# Altium project Modulo_NodoConexion.PrjPcb
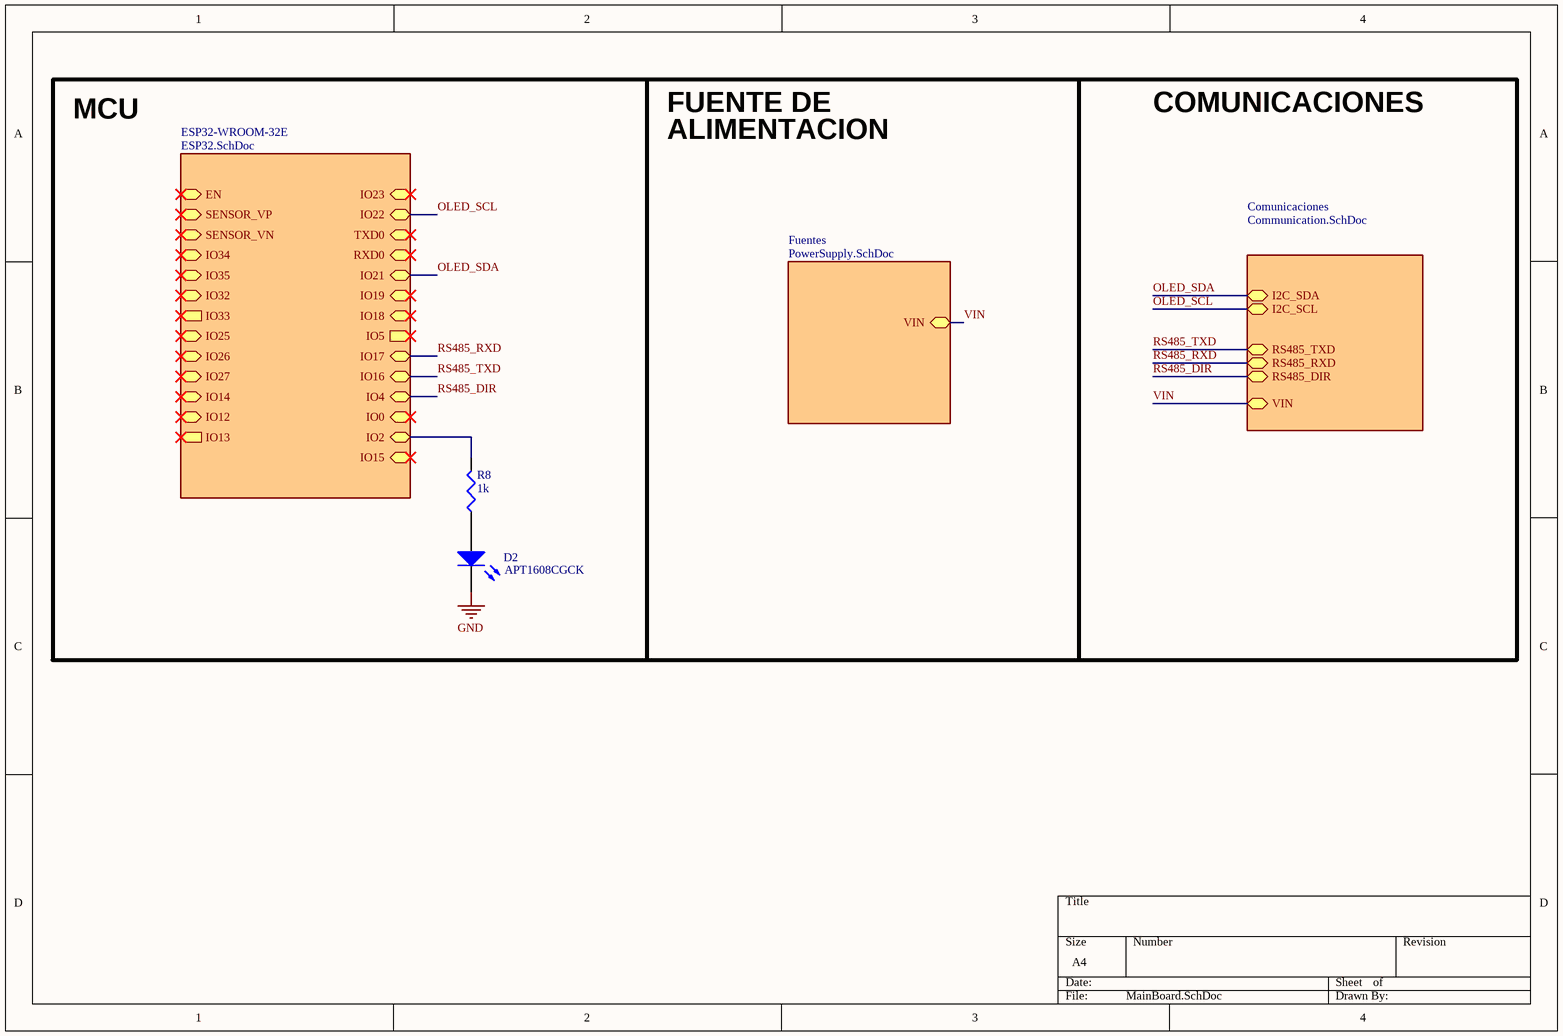
[diagram p0: MainBoard.SchDoc]
4 sheets, 43 parts. Net scope: hierarchical (ports join the sheet entries above them; power ports are global).
Board file: Modulo_Nodo.PcbDoc
Sheets:
  MainBoard.SchDoc
    ESP32-WROOM-32E = ESP32.SchDoc
    Fuentes = PowerSupply.SchDoc
    Comunicaciones = Communication.SchDoc

## Sheet MainBoard.SchDoc
size A4

### Parts
D2  APT1608CGCK  [ChipDiode1608]
R8  1k  [RESC2012N]

### Sub-sheets
Comunicaciones = Communication.SchDoc: I2C_SDA, I2C_SCL, VIN, RS485_DIR, RS485_RXD, RS485_TXD
ESP32-WROOM-32E = ESP32.SchDoc: SENSOR_VN, IO34, SENSOR_VP, IO35, IO32, IO33 (out), IO25, IO26, IO27, IO14, IO12, IO13 (out), IO22, TXD0, RXD0, IO15, IO23, IO21, IO19, IO18, IO5 (out), IO17, IO16, IO4, IO0, IO2, EN
Fuentes = PowerSupply.SchDoc: VIN

### Nets
GND: D2.2(K)
OLED_SCL: sheet ESP32-WROOM-32E/IO22, sheet Comunicaciones/I2C_SCL
OLED_SDA: sheet ESP32-WROOM-32E/IO21, sheet Comunicaciones/I2C_SDA
RS485_DIR: sheet ESP32-WROOM-32E/IO4, sheet Comunicaciones/RS485_DIR
RS485_RXD: sheet ESP32-WROOM-32E/IO17, sheet Comunicaciones/RS485_RXD
RS485_TXD: sheet ESP32-WROOM-32E/IO16, sheet Comunicaciones/RS485_TXD
VIN: sheet Fuentes/VIN, sheet Comunicaciones/VIN
NetD2_1: D2.1(A) R8.1
NetR8_2: R8.2 ; sheet ESP32-WROOM-32E/IO2

### Notes on the sheet
- FUENTE DE
- COMUNICACIONES
- MCU
- ALIMENTACION

### Library data of the parts
D2 = LED2: LED 1.6x0.8 mm 570 nm GRN CLR SMD; Published: 8-Jun-2000; LatestRevisionDate: 17-Jul-2002; LatestRevisionNote: Re-released for DXP Platform.; PackageVersion: Feb-2002; PackageReference: 3.2X1.6X1.1; Publisher: Altium Limited; PackageDescription: SM LED; 2 Flat Leads
R8 = Res3: Resistor; Published: 8-Jun-2000; LatestRevisionDate: 29-May-2009; LatestRevisionNote: IPC-7351 Footprint Added.; PackageReference: J1-0603; Publisher: Altium Limited; PackageDescription: Chip Resistor; Value: 1K

## Sheet ESP32.SchDoc: Microcontrolador
size A4; Author: Matias Herrera
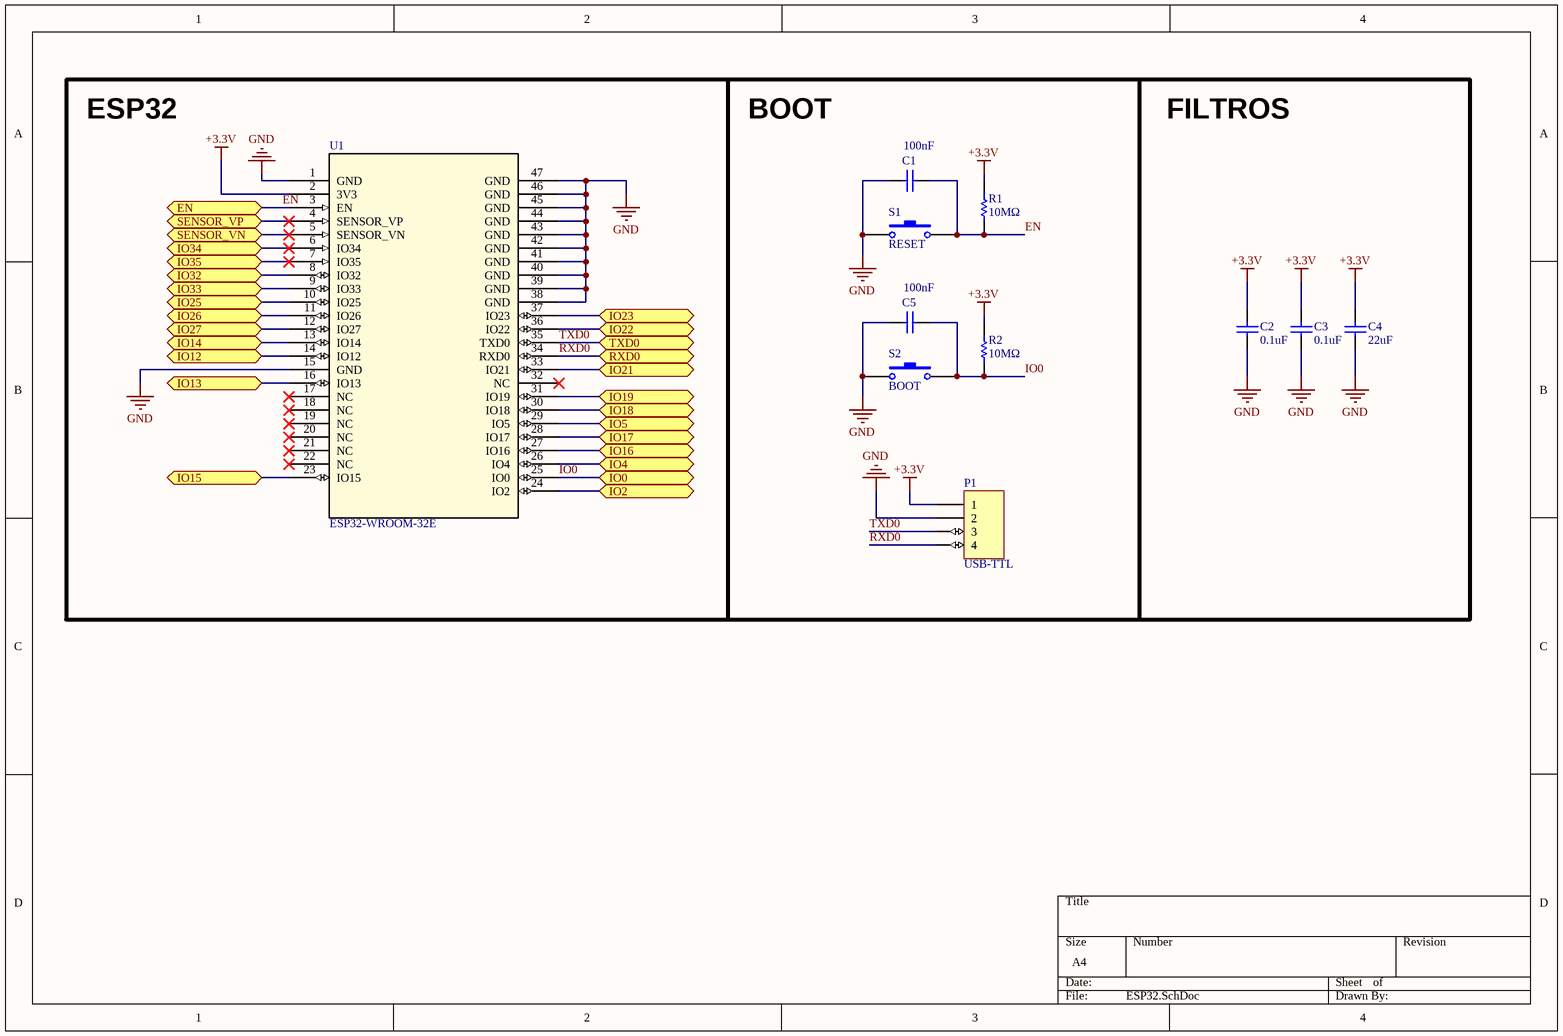
[diagram p1: ESP32.SchDoc]

### Parts
C1  100nF  [CAPC2012N]
C2  0.1uF  [CAPC2012N]
C3  0.1uF  [CAPC2012N]
C4  22uF  [CAPC2012N]
C5  100nF  [CAPC2012N]
P1  USB-TTL  [CONNHDR_1X4_2.54MM]
R1  10MΩ  [RESC2012N]
R2  10MΩ  [RESC2012N]
S1  RESET  [SWITCH TACTILE SPST-NO 0.05A 12V]
S2  BOOT  [SWITCH TACTILE SPST-NO 0.05A 12V]
U1  ESP32-WROOM-32E  [ESP32-WROOM-32E]

### Ports
EN (bidir), IO0 (bidir), IO2 (bidir), IO4 (bidir), IO5 (bidir), IO12 (bidir), IO13 (bidir), IO14 (bidir), IO15 (bidir), IO16 (bidir), IO17 (bidir), IO18 (bidir), IO19 (bidir), IO21 (bidir), IO22 (bidir), IO23 (bidir), IO25 (bidir), IO26 (bidir), IO27 (bidir), IO32 (bidir), IO33 (bidir), IO34 (bidir), IO35 (bidir), RXD0 (bidir), SENSOR_VN (bidir), SENSOR_VP (bidir), TXD0 (bidir)

### Nets
+3.3V: C2.1 C3.1 C4.1 P1.1 R1.2 R2.2 U1.2(3V3)
GND: C1.2 C2.2 C3.2 C4.2 C5.2 P1.2 S1.1 S2.1 U1.1(GND) U1.15(GND) U1.38(GND) U1.39(GND) U1.40(GND) U1.41(GND) U1.42(GND) U1.43(GND) U1.44(GND) U1.45(GND) U1.46(GND) U1.47(GND)
EN: C1.1 R1.1 S1.2 U1.3(EN) ; port EN
IO0: C5.1 R2.1 S2.2 U1.25(IO0) ; port IO0
OLED_SCL: U1.36(IO22) ; port IO22
OLED_SDA: U1.33(IO21) ; port IO21
RS485_DIR: U1.26(IO4) ; port IO4
RS485_RXD: U1.28(IO17) ; port IO17
RS485_TXD: U1.27(IO16) ; port IO16
RXD0: P1.4 U1.34(RXD0) ; port RXD0
TXD0: P1.3 U1.35(TXD0) ; port TXD0
NetR8_2: U1.24(IO2) ; port IO2
NetU1_4: U1.4(SENSOR_VP) ; port SENSOR_VP
NetU1_5: U1.5(SENSOR_VN) ; port SENSOR_VN
NetU1_6: U1.6(IO34) ; port IO34
NetU1_7: U1.7(IO35) ; port IO35
NetU1_8: U1.8(IO32) ; port IO32
NetU1_9: U1.9(IO33) ; port IO33
NetU1_10: U1.10(IO25) ; port IO25
NetU1_11: U1.11(IO26) ; port IO26
NetU1_12: U1.12(IO27) ; port IO27
NetU1_13: U1.13(IO14) ; port IO14
NetU1_14: U1.14(IO12) ; port IO12
NetU1_16: U1.16(IO13) ; port IO13
NetU1_23: U1.23(IO15) ; port IO15
NetU1_29: U1.29(IO5) ; port IO5
NetU1_30: U1.30(IO18) ; port IO18
NetU1_31: U1.31(IO19) ; port IO19
NetU1_37: U1.37(IO23) ; port IO23

Not connected (* = marked no-connect by the designer): U1 17(NC)* 18(NC)* 19(NC)* 20(NC)* 21(NC)* 22(NC)* 32(NC)*

### Notes on the sheet
- ESP32
- BOOT
- FILTROS

### Library data of the parts
C1 C5 = Cap: Capacitor; Published: 8-Jun-2000; LatestRevisionDate: 17-Jul-2002; LatestRevisionNote: Re-released for DXP Platform.; PackageReference: RAD-0.3; Publisher: Altium Limited; PackageDescription: Radial Cap, Thru-Hole; 2 Leads; 0.3 in Pin Spacing; Value: 100nF
C2-C4 = Cap: Capacitor; Value: 100pF; Published: 8-Jun-2000; LatestRevisionDate: 17-Jul-2002; LatestRevisionNote: Re-released for DXP Platform.; PackageReference: RAD-0.3; Publisher: Altium Limited; PackageDescription: Radial Cap, Thru-Hole; 2 Leads; 0.3 in Pin Spacing
P1 = MHDR1X4: Header, 4-Pin; LatestRevisionDate: 17-Jul-2002; LatestRevisionNote: Re-released for DXP Platform.; Publisher: Altium Limited
R1 R2 = Res1: Resistor; Value: 1M; Published: 8-Jun-2000; LatestRevisionDate: 17-Jul-2002; LatestRevisionNote: Re-released for DXP Platform.; PackageReference: AXIAL-0.3; Publisher: Altium Limited; PackageDescription: Axial Device, Thru-Hole; 2 Leads; 0.3 in Pin Spacing
S1 S2 = SW-PB: Switch; Published: 24-Mar-1999; LatestRevisionDate: 17-Jul-2002; LatestRevisionNote: Re-released for DXP Platform.; PackageReference: SPST-2; Publisher: Altium Limited; PackageDescription: Switch; 2 Leads

## Sheet PowerSupply.SchDoc
size A4
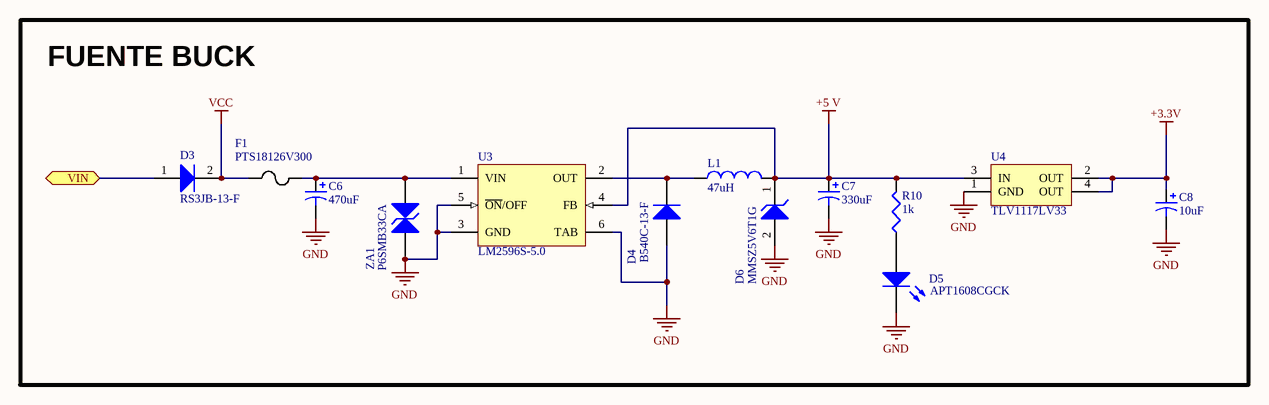
[diagram p2: PowerSupply.SchDoc]

### Parts
C6  470uF  [CapElecSMD_10mm]
C7  330uF  [CapElecSMD_8mm]
C8  10uF  [CAPC3225N]
D3  RS3JB-13-F  [SMB]
D4  B540C-13-F  [SMC]
D5  APT1608CGCK  [ChipDiode1608]
D6  MMSZ5V6T1G  [SOD-123_ONS-M]
F1  PTS18126V300  [FUSE_PTS18126_COB]
L1  47uH  [INDUCTOR_47UH_3A]
R10  1k  [RESC2012N]
U3  LM2596S-5.0  [LM2596S-5.0]
U4  TLV1117LV33  [SOT223]
ZA1  P6SMB33CA  [SMB]

### Blocks framed on the sheet
FUENTE BUCK: C6-C8 D3-D6 F1 L1 R10 U3 U4 ZA1

### Ports
VIN

### Nets
+3.3V: C8.1 U4.2(OUT) U4.4(OUT)
+5 V: C7.1 D6.1(K) L1.2 R10.2 U3.4(FB) U4.3(IN)
GND: C6.2 C7.2 C8.2 D4.1(A) D5.2(K) D6.2(A) U3.3(GND) U3.5(~{ON}/OFF) U3.6(TAB) U4.1(GND) ZA1.2
VCC: D3.2(K) F1.1
VIN: D3.1(A) ; port VIN
NetC6_1: C6.1 F1.2 U3.1(VIN) ZA1.1
NetD4_2: D4.2(K) L1.1 U3.2(OUT)
NetD5_1: D5.1(A) R10.1

### Library data of the parts
C6-C8 = Cap Pol3: Polarized Capacitor (Surface Mount); Published: 8-Jun-2000; LatestRevisionDate: 29-May-2009; LatestRevisionNote: IPC-7351 Footprint Added.; PackageReference: C0805; Publisher: Altium Limited; PackageDescription: Chip Capacitor
  C6: Value: 470uF
  C7: Value: 330uF
  C8: Value: 10uF
D3 D4 = Diode: Default Diode; Published: 8-Jun-2000; LatestRevisionDate: 17-Jul-2002; LatestRevisionNote: Re-released for DXP Platform.; PackageVersion: Sep-1996; PackageReference: SMC; Publisher: Altium Limited; PackageDescription: DO-214-AB/SMC; 2 C-Bend Leads; Body 7.9 x 5.9 mm, inc. leads (LxW); Code_JEDEC: DO-214-AB
D5 = LED2: LED 1.6x0.8 mm 570 nm GRN CLR SMD; Published: 8-Jun-2000; LatestRevisionDate: 17-Jul-2002; LatestRevisionNote: Re-released for DXP Platform.; PackageVersion: Feb-2002; PackageReference: 3.2X1.6X1.1; Publisher: Altium Limited; PackageDescription: SM LED; 2 Flat Leads
D6 = D Zener: Zener Diode; Published: 8-Jun-2000; LatestRevisionDate: 17-Jul-2002; LatestRevisionNote: Re-released for DXP Platform.; PackageReference: DIODE-0.7; Publisher: Altium Limited; PackageDescription: Diode, Thru-Hole; 2 Leads; 0.7 in Pin Spacing
F1 = PTS18126V300: PTC RESET FUSE 6V 3A 1812; Mfr_Name: Eaton
L1 = Inductor: Code_IEC: 1005; Published: 8-Jun-2000; LatestRevisionDate: 29-May-2009; LatestRevisionNote: IPC-7351 Footprint Added.; PackageReference: 0402-A; Publisher: Altium Limited; PackageDescription: Chip Inductor; Code_JEITA: 0402; Value: 47uH
R10 = Res3: Resistor; Published: 8-Jun-2000; LatestRevisionDate: 29-May-2009; LatestRevisionNote: IPC-7351 Footprint Added.; PackageReference: J1-0603; Publisher: Altium Limited; PackageDescription: Chip Resistor; Value: 1K
U3 = LM2596S-5.0: IC REG BUCK 5V 3A TO263-5L
U4 = TLV1117LV33: 1-A, Positive Fixed Voltage, Low-Dropout Regulator
ZA1 = TVS Diode: Transient voltage suppressor diode

## Sheet Communication.SchDoc
size A4; ApprovedBy: G. Zeitune; CheckedBy: J. Fiszman; DrawnBy: M. Mainenti; DocumentNumber: 1; Revision: 2; SheetNumber: 1; SheetTotal: 1
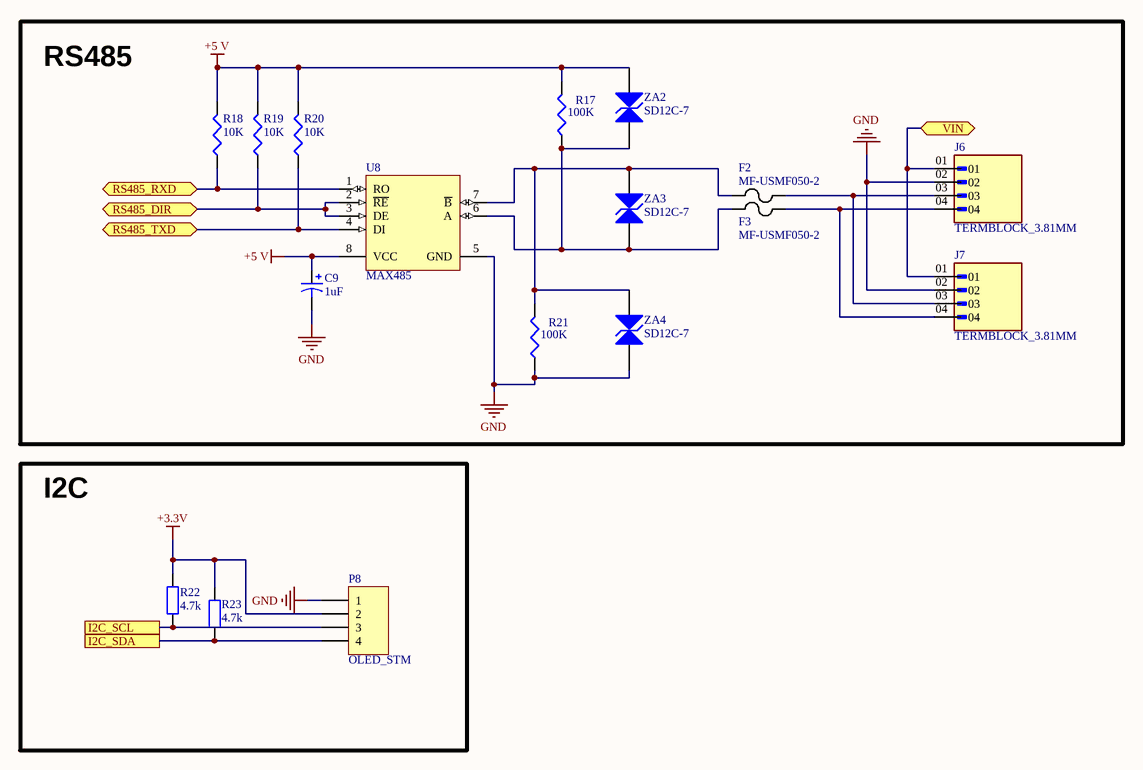
[diagram p3: Communication.SchDoc]

### Parts
C9  1uF  [CAPC3225N]
F2  MF-USMF050-2  [MF-USMF050-2]
F3  MF-USMF050-2  [MF-USMF050-2]
J6  TERMBLOCK_3.81MM  [TERMBLOCK_3.81MM_90DEG_4POS]
J7  TERMBLOCK_3.81MM  [TERMBLOCK_3.81MM_90DEG_4POS]
P8  OLED_STM  [CONNHDR_1X4_2.54MM]
R17  100K  [RESC2012N]
R18  10K  [RESC2012N]
R19  10K  [RESC2012N]
R20  10K  [RESC2012N]
R21  100K  [RESC2012N]
R22  4.7k  [RESC2012N]
R23  4.7k  [RESC2012N]
U8  MAX485  [MAX485]
ZA2  SD12C-7  [SOD-323]
ZA3  SD12C-7  [SOD-323]
ZA4  SD12C-7  [SOD-323]

### Blocks framed on the sheet
RS485: C9 F2 F3 J6 J7 R17-R21 U8 ZA2-ZA4
I2C: P8 R22 R23

### Ports
I2C_SCL, I2C_SDA, RS485_DIR (bidir), RS485_RXD (bidir), RS485_TXD (bidir), VIN

### Nets
+3.3V: P8.2 R22.2 R23.2
+5 V: C9.1 R17.2 R18.2 R19.2 R20.2 U8.8(VCC) ZA2.1
GND: C9.2 J6.02 J7.02 P8.1 R21.1 U8.5(GND) ZA4.2
OLED_SCL: P8.3 R22.1 ; port I2C_SCL
OLED_SDA: P8.4 R23.1 ; port I2C_SDA
RS485_DIR: R19.1 U8.2(~{RE}) U8.3(DE) ; port RS485_DIR
RS485_RXD: R18.1 U8.1(RO) ; port RS485_RXD
RS485_TXD: R20.1 U8.4(DI) ; port RS485_TXD
VIN: J6.01 J7.01 ; port VIN
NetF2_1: F2.1 R21.2 U8.7(~{B}) ZA3.1 ZA4.1
NetF2_2: F2.2 J6.03 J7.03
NetF3_1: F3.1 R17.1 U8.6(A) ZA2.2 ZA3.2
NetF3_2: F3.2 J6.04 J7.04

### Notes on the sheet
- Title
- Size:
- Date:
- A4
- Number:
- Time:
- Revision:
- Sheet
- of
- File:

### Library data of the parts
C9 = Cap Pol3: Polarized Capacitor (Surface Mount); Value: 0.1uF; Published: 8-Jun-2000; LatestRevisionDate: 29-May-2009; LatestRevisionNote: IPC-7351 Footprint Added.; PackageReference: C0805; Publisher: Altium Limited; PackageDescription: Chip Capacitor
F2 F3 = PTS18126V300: as F1 on sheet PowerSupply
J6 J7 = TERMBLOCK_3.81MM_90DEG_4POS: TERMBLOCK_3.81MM_90DEG_4POS (DigiKey: 1803293)
P8 = MHDR1X4: Header, 4-Pin; LatestRevisionDate: 17-Jul-2002; LatestRevisionNote: Re-released for DXP Platform.; Publisher: Altium Limited
R17-R21 = Res3: Resistor; Published: 8-Jun-2000; LatestRevisionDate: 29-May-2009; LatestRevisionNote: IPC-7351 Footprint Added.; PackageReference: J1-0603; Publisher: Altium Limited; PackageDescription: Chip Resistor
  R17 R21: Value: 100K
  R18-R20: Value: 10K
R22 R23 = Res2: Resistor; Value: 1K; Published: 8-Jun-2000; LatestRevisionDate: 17-Jul-2002; LatestRevisionNote: Re-released for DXP Platform.; PackageReference: AXIAL-0.4; Publisher: Altium Limited; PackageDescription: Axial Device, Thru-Hole; 2 Leads; 0.4 in Pin Spacing
U8 = MAX485: Low-Power RS-485/RS-422 Multipoint Transceiver, 8-pin Narrow SOIC
ZA2-ZA4 = TVS Diode: Transient voltage suppressor diode

## Nets that join several sheets
+3.3V: ESP32 (7 pins), PowerSupply (C8.1 U4.2 U4.4), Communication (P8.2 R22.2 R23.2)
+5 V: PowerSupply (6 pins), Communication (7 pins)
GND: MainBoard (D2.2), ESP32 (20 pins), PowerSupply (11 pins), Communication (7 pins)
NetR8_2: MainBoard (R8.2), ESP32 (U1.24)
OLED_SCL: ESP32 (U1.36), Communication (P8.3 R22.1)
OLED_SDA: ESP32 (U1.33), Communication (P8.4 R23.1)
RS485_DIR: ESP32 (U1.26), Communication (R19.1 U8.2 U8.3)
RS485_RXD: ESP32 (U1.28), Communication (R18.1 U8.1)
RS485_TXD: ESP32 (U1.27), Communication (R20.1 U8.4)
VIN: PowerSupply (D3.1), Communication (J6.01 J7.01)